# Altium schematic sheet External_Flash.SchDoc
size 193 x 146 mm; SheetNumber: 3; SheetTotal: 29
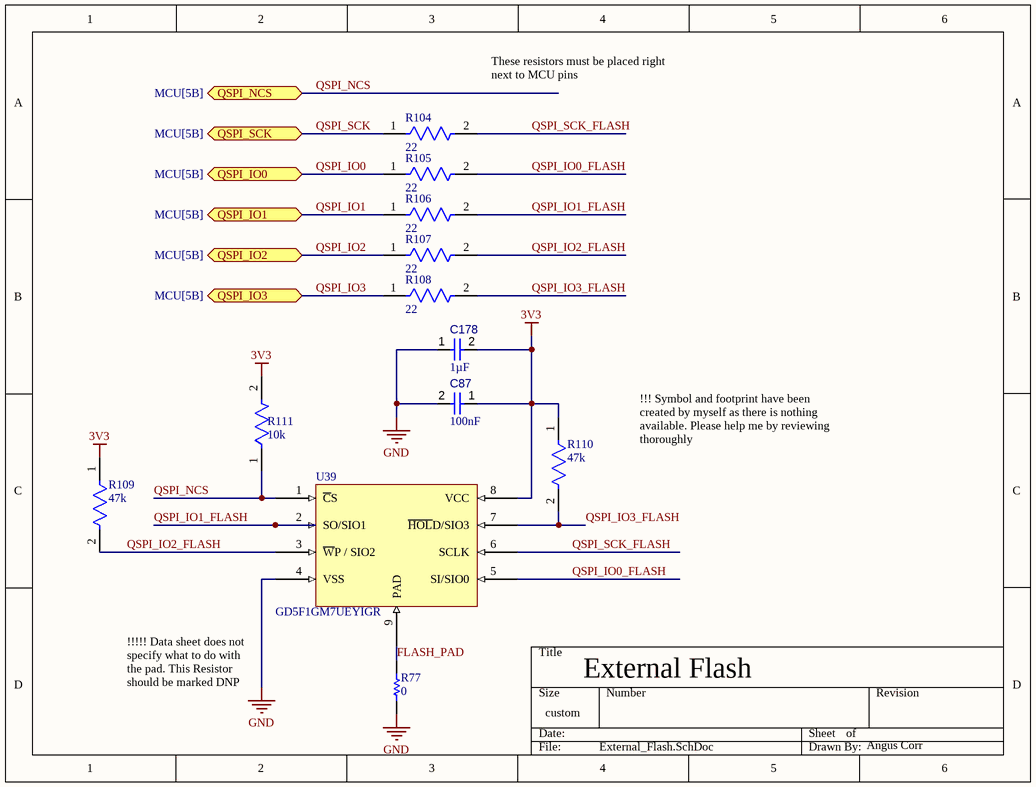
[diagram p0: External_Flash.SchDoc]

## Parts
C87  value 100nF  [CAPC1608X90X40NL10T20]  (hidden comment: Capacitor 100 nF +/-10% 50 V 0603)
C178  value 1µF  [CAPC1608X90X40LL10T20]  (hidden comment: Capacitor 1 uF +/- 10% 25 V 0603)
R77  value 0  [RESC1608X55X25ML10T15]  (hidden comment: Resistor 0R +/- 5% 0603 100 mW)
R104  value 22  [FP-RC0603-0_55-IPC_A]  (hidden comment: RC0603JR-0722RL)
R105  value 22  [FP-RC0603-0_55-IPC_A]  (hidden comment: RC0603JR-0722RL)
R106  value 22  [FP-RC0603-0_55-IPC_A]  (hidden comment: RC0603JR-0722RL)
R107  value 22  [FP-RC0603-0_55-IPC_A]  (hidden comment: RC0603JR-0722RL)
R108  value 22  [FP-RC0603-0_55-IPC_A]  (hidden comment: RC0603JR-0722RL)
R109  value 47k  [FP-AC0603-IPC_A]  (hidden comment: AC0603DR-0747KL)
R110  value 47k  [FP-AC0603-IPC_A]  (hidden comment: AC0603DR-0747KL)
R111  value 10k  [FP-RT0603-IPC_A]  (hidden comment: RT0603BRD0710KL)
U39  GD5F1GM7UEYIGR  [PSON127P800X80_HS-9M]

## Ports
QSPI_IO0 (bidir, see MCU[5B]), QSPI_IO1 (bidir, see MCU[5B]), QSPI_IO2 (bidir, see MCU[5B]), QSPI_IO3 (bidir, see MCU[5B]), QSPI_NCS (bidir, see MCU[5B]), QSPI_SCK (bidir, see MCU[5B])

## Nets
3V3: C87.1 C178.2 R109.1 R110.1 R111.2 U39.8(VCC)
GND: C87.2 C178.1 R77.2 U39.4(VSS)
FLASH_PAD: R77.1 U39.9(PAD)
QSPI_IO0: R105.1 ; port QSPI_IO0
QSPI_IO0_FLASH: R105.2 U39.5(SI/SIO0)
QSPI_IO1: R106.1 ; port QSPI_IO1
QSPI_IO1_FLASH: R106.2 U39.2(SO/SIO1)
QSPI_IO2: R107.1 ; port QSPI_IO2
QSPI_IO2_FLASH: R107.2 R109.2 U39.3(~{W}P_/_SIO2)
QSPI_IO3: R108.1 ; port QSPI_IO3
QSPI_IO3_FLASH: R108.2 R110.2 U39.7(~{HOL}D/SIO3)
QSPI_NCS: R111.1 U39.1(~{C}S) ; port QSPI_NCS
QSPI_SCK: R104.1 ; port QSPI_SCK
QSPI_SCK_FLASH: R104.2 U39.6(SCLK)

## Notes on the sheet
- These resistors must be placed right next to MCU pins
- !!! Symbol and footprint have been created by myself as there is nothing available. Please help me by reviewing thoroughly
- !!!!! Data sheet does not specify what to do with the pad. This Resistor should be marked DNP for assembly?
- External Flash
- Angus Corr

## Library data of the parts
C87 = CMP-001-00017-6: Chip Capacitor, 100 nF, +/- 10%, 50 V, 0603 (1608 Metric); Voltage Rating: 50V; Capacitor Type: Ceramic; Tolerance: 10%; Mounting Technology: SM; Max Operating Temperature: 125°C; RoHS Compliant: True; Pins: 2; Case/Package: 0603; Min Operating Temperature: -55°C
C178 = CMP-001-00005-6: Chip Capacitor, 1 uF, +/- 10%, 25 V, 0603 (1608 Metric); Capacitor Type: Ceramic; Voltage Rating: 25V; Pins: 2; Mounting Technology: SM; RoHS Compliant: True; Max Operating Temperature: 125°C; Case/Package: 0603; Min Operating Temperature: -55°C; Tolerance: 10%
R77 = CMP-009-00006-5: Chip Resistor, 0 Ohm, 0.1 W, -55 to 155 degC, 0603 (1608 Metric); Power: 100mW; Voltage Rating: 50V; Max Operating Temperature: 155°C; RoHS Compliant: True; Mounting Technology: SM; Case/Package: 0603; Min Operating Temperature: -55°C; Tolerance: 5%; Pins: 2
R104-R108 = CMP-009-00321-1: 100mW Thick Film Resistors 75V ±100ppm/℃ ±5% 22Ω 0603 Chip Resistor - Surface Mount ROHS; Temperature Coefficient: 100ppm/°C; Voltage Rating: 50V; Tolerance: 5%; Lifecycle Status: Production; Lead Free: Lead Free; Termination: SMD/SMT; Case/Package: 0603; Military Standard: Not; Working Voltage: 75V; Max Operating Temperature: 155°C; Pins: 2; Composition: Thick Film; REACH SVHC: Yes; Min Operating Temperature: -55°C; Power Rating: 100mW; Width: 800µm; Voltage Rating (AC): 50V; China RoHS: Non-Compliant; Country of Origin: Mainland China, Taiwan; Depth: 800µm; Height: 450µm; Schedule B: 8533210045, 8533210045; Number of Terminals: 2; RoHS: Compliant; Voltage Rating (DC): 50V; Length: 1.6mm; Mounting Technology: Surface Mount; Radiation Hardening: No; Harmonized Tariff Schedule (HTS) Code: 8533.21.00.30; Contact Plating: Tin; Export Control Classification Number (ECCN) Code: EAR99; Packaging: Tape & Reel; Case Code (Imperial): 0603; Introduction Date: 2004-09-22
R109 R110 = CMP-009-00334-1: Fixed Resistor, Metal Glaze/thick Film, 0.1W, 47000ohm, 75V, 0.5% +/-Tol, 100ppm/Cel, Surface Mount, 0603; Power Rating: 100mW; Temperature Coefficient: 100ppm/°C; REACH SVHC: Yes; Tolerance: 0.5%; Width: 800µm; Mounting Technology: Surface Mount; Packaging: Tape & Reel; Number of Terminals: 2; China RoHS: Non-Compliant; Working Voltage: 75V; Ratings: AEC-Q200; Min Operating Temperature: -55°C; Composition: Thick Film; Max Operating Temperature: 155°C; Case/Package: 0603; RoHS: Compliant; Lifecycle Status: Production; Length: 1.6mm; Voltage Rating: 75V; Height: 450µm
R111 = CMP-009-00322-1: Res Thin Film 0603 10K Ohm 0.1% 1/10W |25ppm/|C SMD Paper T/R; Voltage Rating: 75V; Max Power Dissipation: 100mW; Temperature Coefficient: 25ppm/°C; Min Operating Temperature: -55°C; Case/Package: 0603; Mounting Technology: Surface Mount; Max Operating Temperature: 155°C; Tolerance: 0.1%; Case Code (Imperial): 0603; China RoHS: Non-Compliant; Composition: Thin Film; Country of Origin: Mainland China, Taiwan; Depth: 800µm; Export Control Classification Number (ECCN) Code: EAR99; Features: Moisture Resistant; Harmonized Tariff Schedule (HTS) Code: 8533.21.00.30; Height: 450µm; Introduction Date: 2008-06-09; Lead Free: Lead Free; Length: 1.6mm; Lifecycle Status: Production; Military Standard: Not; Number of Terminals: 2; Number of Terminations: 2; Power Rating: 100mW; REACH SVHC: Yes; RoHS: Compliant; Schedule B: 8533210045, 8533210045; Termination: SMD/SMT; Voltage Rating (DC): 75V; Weight: 2.012816mg; Width: 800µm; Working Voltage: 75V
U39 = CMP-019-00066-1: Spi Nand Flash (with Ecc), 1GBIT,